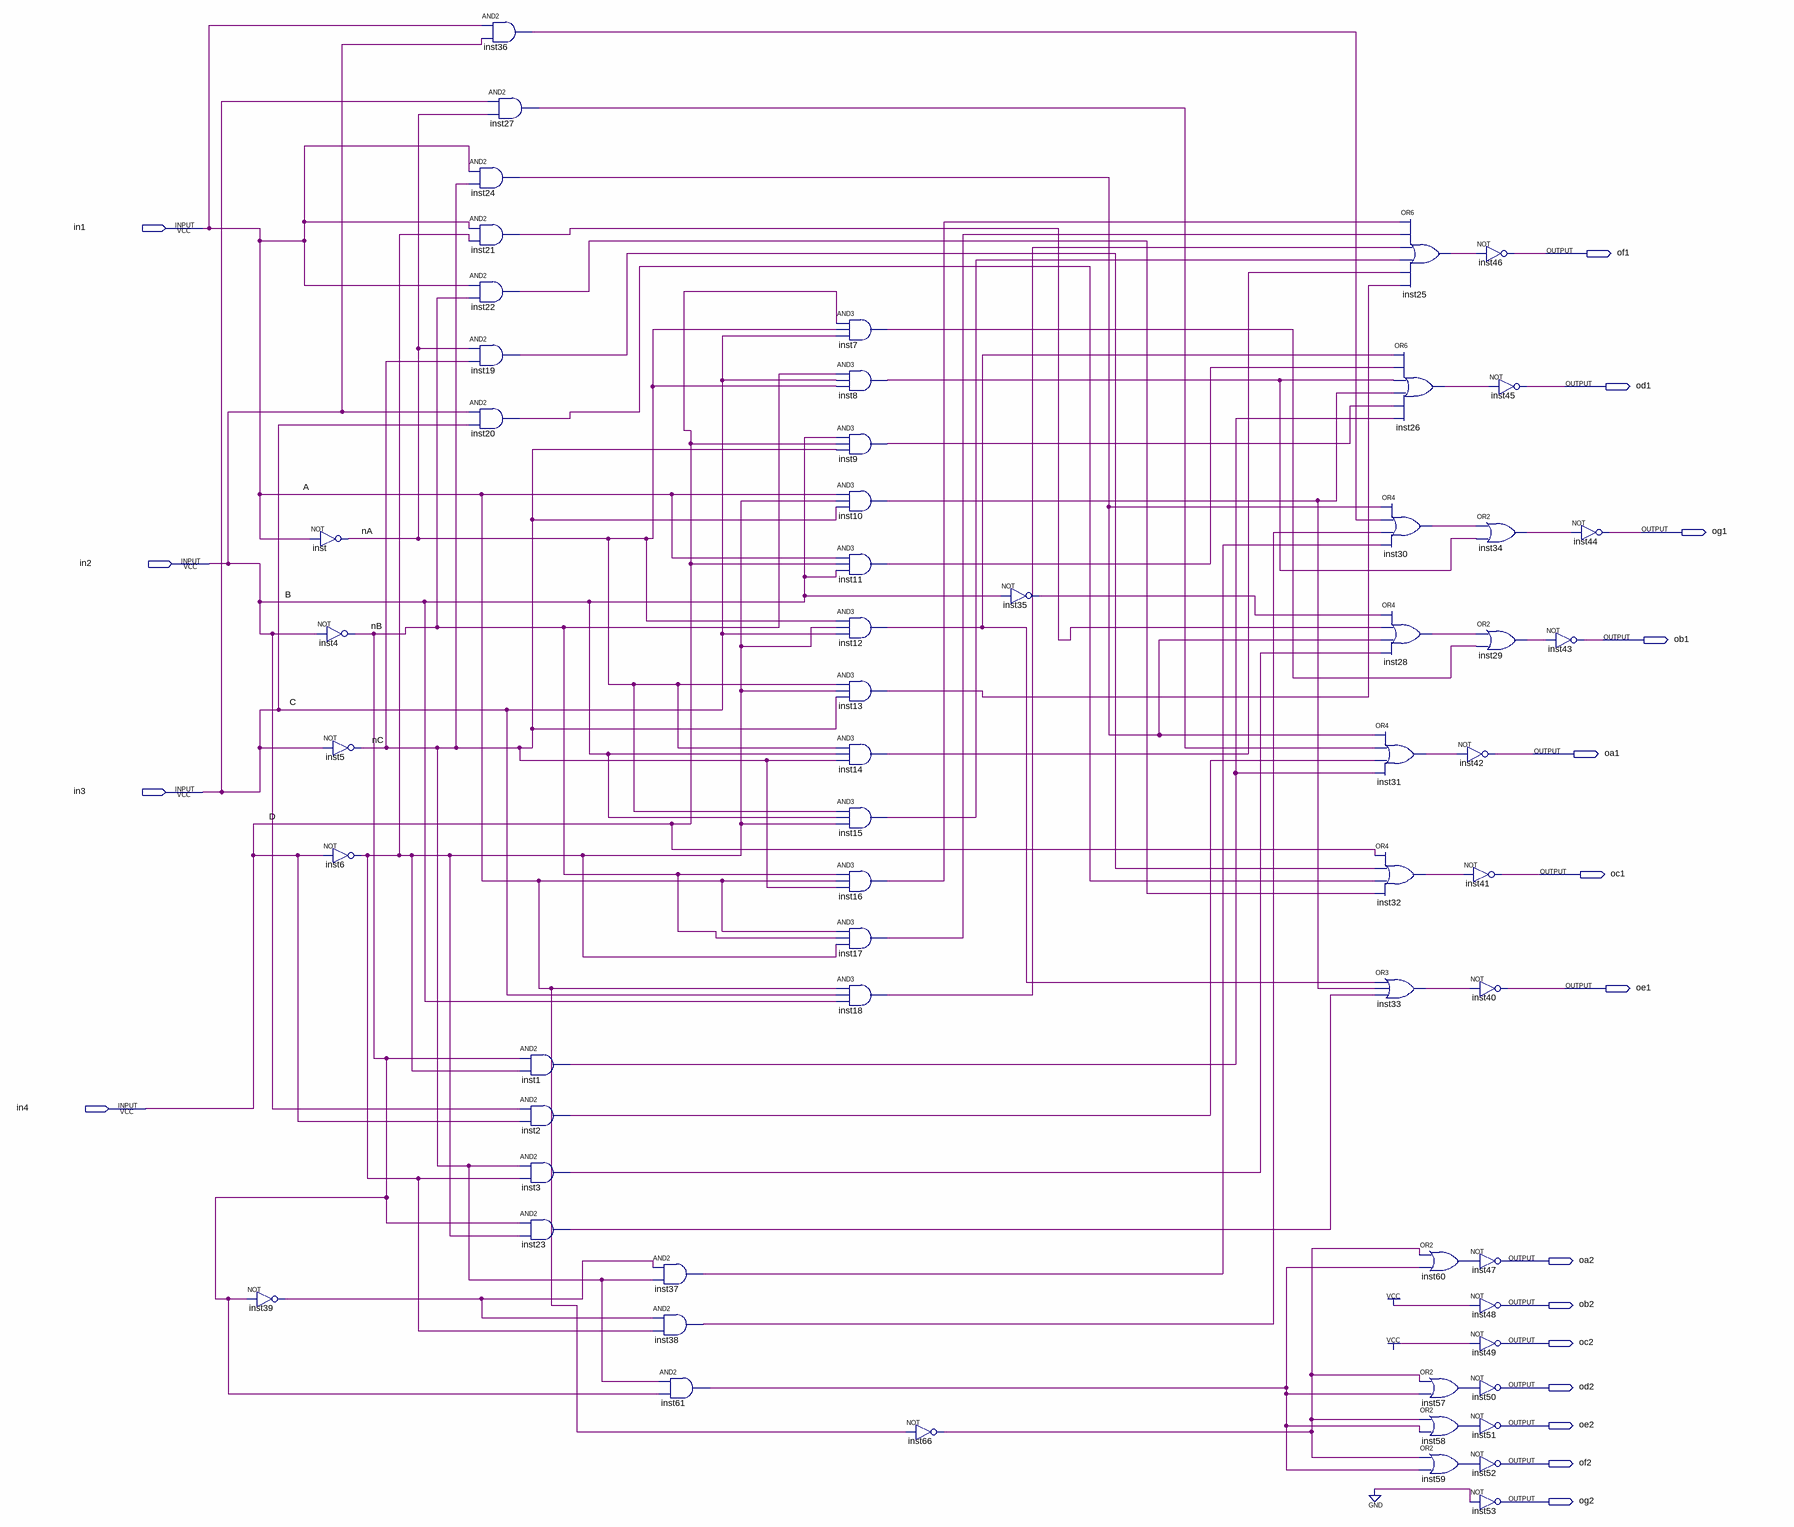
[diagram p0: schematic sheet]
// Quartus schematic bcd14seg.bdf as structural Verilog: 60 symbols, 18 pins
module bcd14seg (
  input  in1,
  input  in2,
  input  in3,
  input  in4,
  output of1,
  output od1,
  output og1,
  output ob1,
  output oa1,
  output oc1,
  output oe1,
  output oa2,
  output ob2,
  output oc2,
  output od2,
  output oe2,
  output of2,
  output og2
);

  wire inst1_out, inst2_out, inst3_out, inst6_out, inst7_out, inst8_out, inst9_out, inst10_out, inst11_out,
       inst12_out, inst13_out, inst14_out, inst15_out, inst16_out, inst17_out, inst18_out, inst19_out,
       inst20_out, inst21_out, inst22_out, inst23_out, inst24_out, inst25_out, inst26_out, inst27_out,
       inst28_out, inst29_out, inst30_out, inst31_out, inst32_out, inst33_out, inst34_out, inst35_out,
       inst36_out, inst37_out, inst38_out, inst39_out, inst57_out, inst58_out, inst59_out, inst60_out,
       inst61_out, inst66_out, nA, nB, nC;

  not inst39 (inst39_out, nB);
  not inst (nA, in1);
  not inst4 (nB, in2);
  not inst5 (nC, in3);
  not inst6 (inst6_out, in4);
  and inst24 (inst24_out, in1, nC);
  and inst21 (inst21_out, in1, inst6_out);
  and inst22 (inst22_out, in1, nB);
  and inst19 (inst19_out, nA, nC);
  and inst20 (inst20_out, in2, in3);
  and inst36 (inst36_out, in1, in2);
  and inst27 (inst27_out, in3, nA);
  and inst1 (inst1_out, nB, inst6_out);
  and inst2 (inst2_out, in2, in4);
  and inst3 (inst3_out, nC, inst6_out);
  and inst23 (inst23_out, nB, inst6_out);
  and inst37 (inst37_out, inst39_out, nC);
  and inst38 (inst38_out, inst39_out, inst6_out);
  and inst61 (inst61_out, nC, nB);
  and inst7 (inst7_out, in4, nA, in3);
  and inst8 (inst8_out, nB, in3, nA);
  and inst9 (inst9_out, in2, in4, nC);
  and inst10 (inst10_out, in1, inst6_out, nC);
  and inst11 (inst11_out, in1, in4, in2);
  and inst12 (inst12_out, nA, inst6_out, in3);
  and inst13 (inst13_out, nA, inst6_out, nC);
  and inst14 (inst14_out, nA, in2, nC);
  and inst15 (inst15_out, nA, in2, inst6_out);
  and inst16 (inst16_out, nB, in1, nC);
  and inst17 (inst17_out, in1, nB, inst6_out);
  and inst18 (inst18_out, in1, in3, in2);
  not inst66 (inst66_out, in1);
  not inst35 (inst35_out, in2);
  or inst30 (inst30_out, inst24_out, inst36_out, inst38_out, inst37_out);
  or inst28 (inst28_out, inst35_out, inst21_out, inst24_out, inst3_out);
  or inst31 (inst31_out, inst24_out, inst27_out, inst2_out, inst1_out);
  or inst32 (inst32_out, in4, inst19_out, inst20_out, inst22_out);
  or inst33 (inst33_out, inst12_out, inst10_out, inst23_out);
  or inst25 (inst25_out, inst16_out, inst17_out, inst18_out, inst15_out, inst14_out, inst13_out);
  or inst26 (inst26_out, inst12_out, inst11_out, inst8_out, inst10_out, inst9_out, inst1_out);
  or inst60 (inst60_out, inst66_out, inst61_out);
  or inst57 (inst57_out, inst66_out, inst61_out);
  or inst58 (inst58_out, inst66_out, inst61_out);
  or inst59 (inst59_out, inst66_out, inst61_out);
  not inst46 (of1, inst25_out);
  not inst45 (od1, inst26_out);
  or inst34 (inst34_out, inst30_out, inst8_out);
  or inst29 (inst29_out, inst28_out, inst7_out);
  not inst42 (oa1, inst31_out);
  not inst41 (oc1, inst32_out);
  not inst40 (oe1, inst33_out);
  not inst47 (oa2, inst60_out);
  not inst48 (ob2, 1'b1);
  not inst49 (oc2, 1'b1);
  not inst50 (od2, inst57_out);
  not inst51 (oe2, inst58_out);
  not inst52 (of2, inst59_out);
  not inst53 (og2, 1'b0);
  not inst44 (og1, inst34_out);
  not inst43 (ob1, inst29_out);

  // Other names for the same wires on the sheet: A = in1; B = in2; C = in3; D = in4
endmodule
